# Altium schematic sheet INC-QT1-R-005.SchDoc
size A3
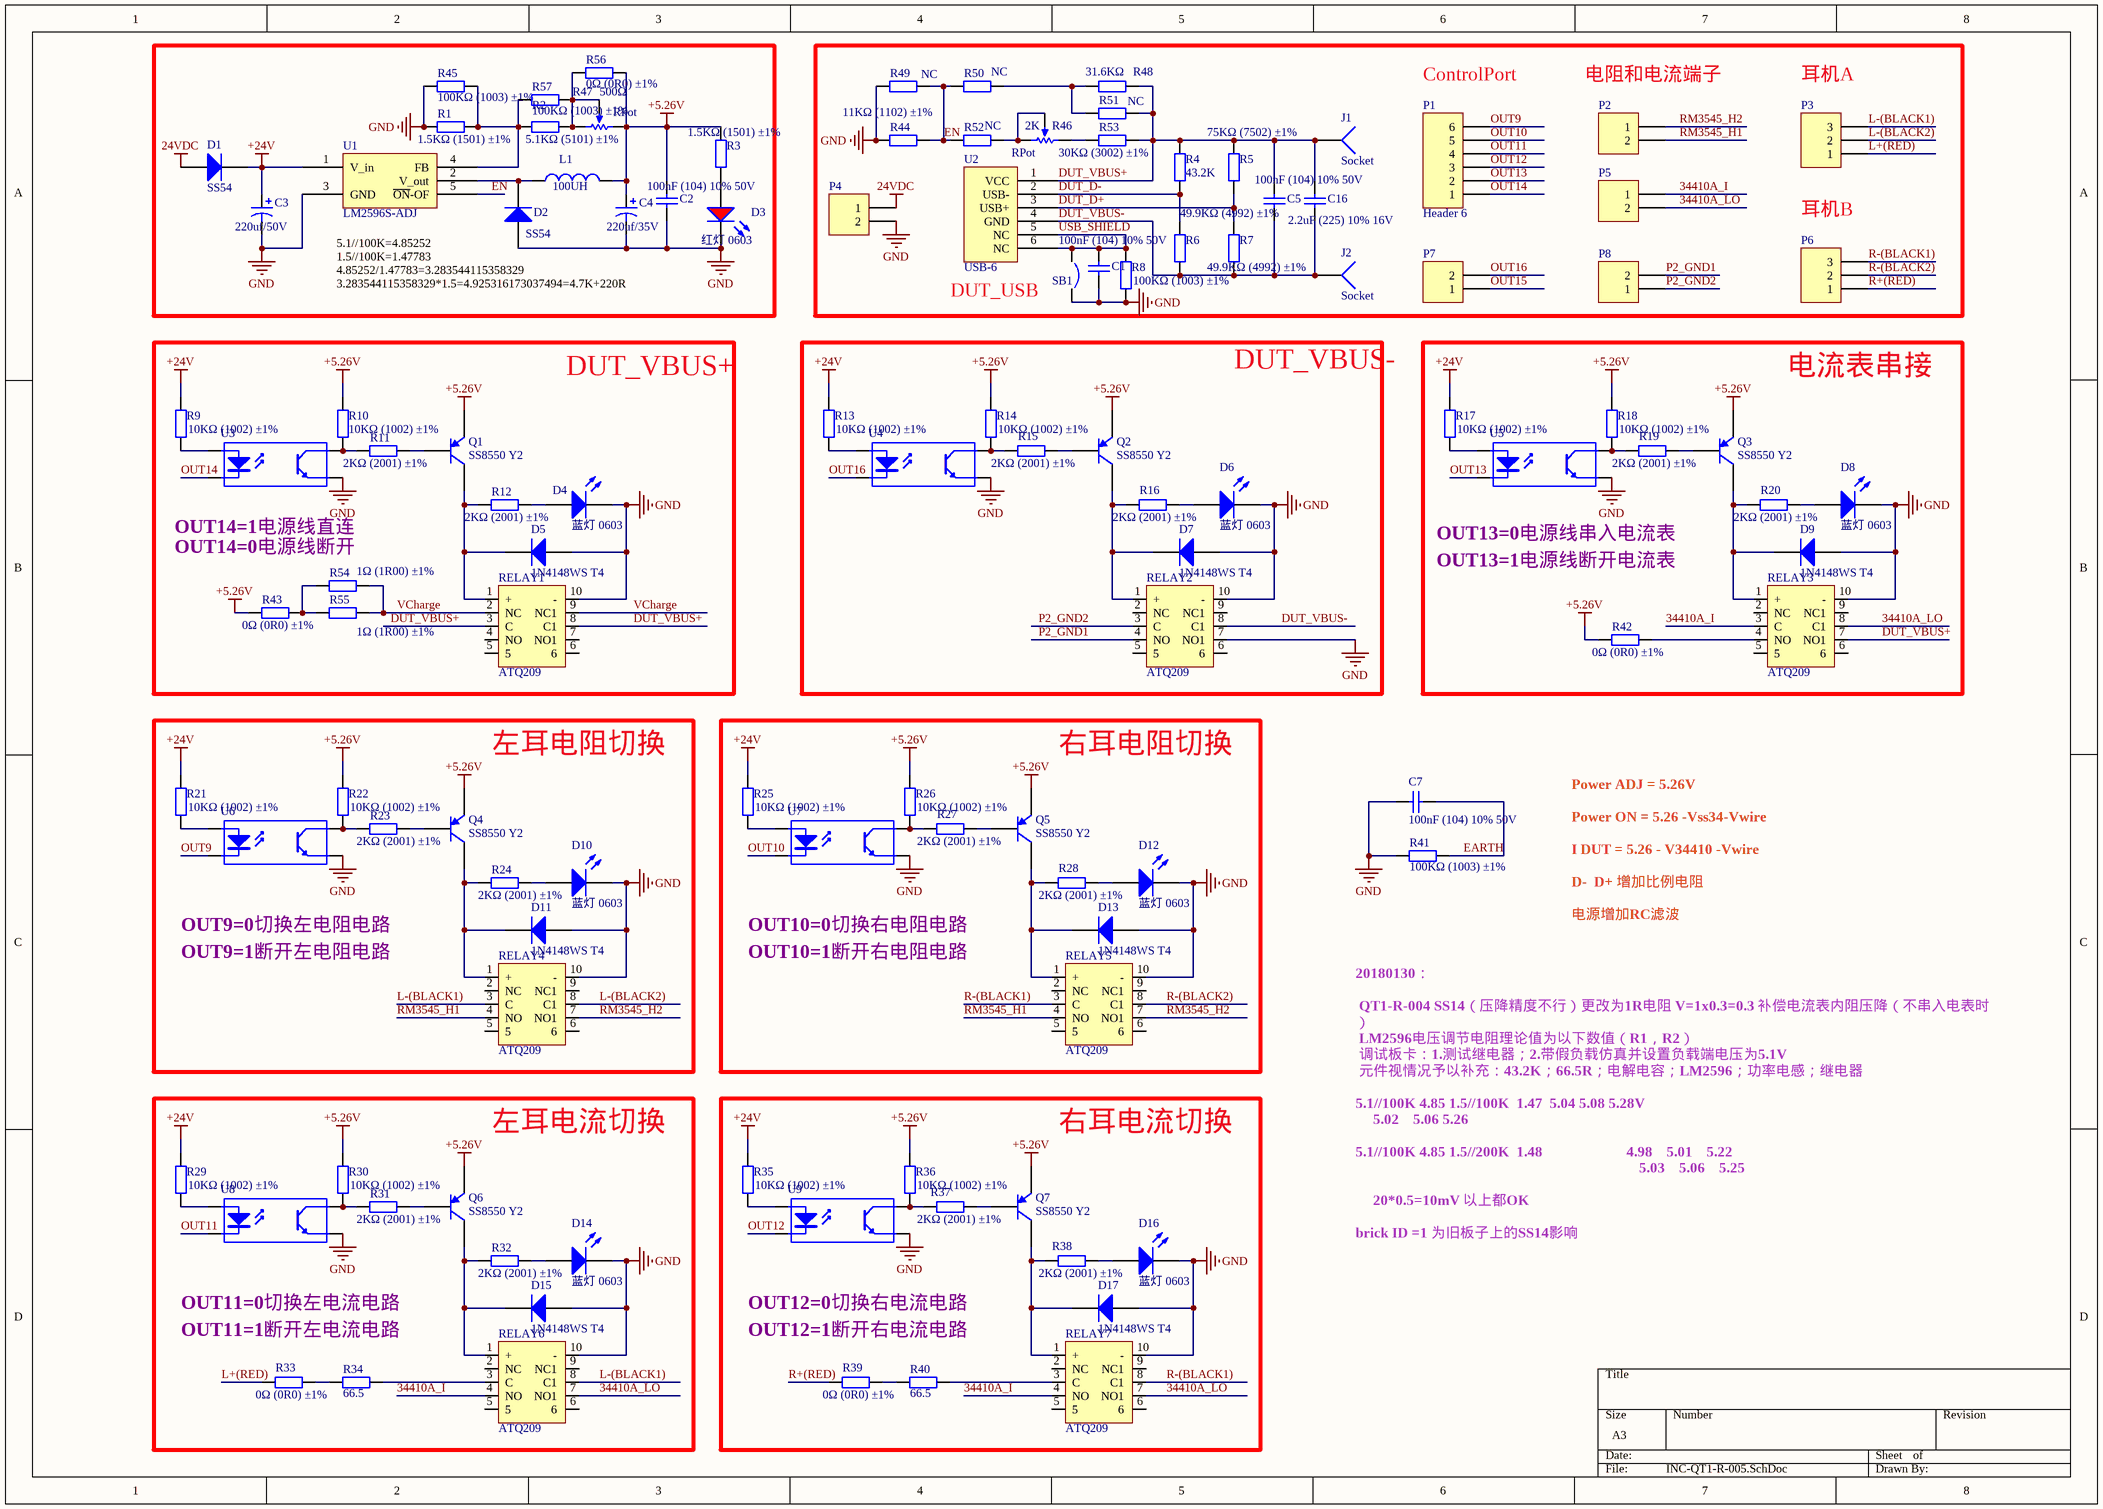
[diagram p0: INC-QT1-R-005.SchDoc]

## Parts
C1  100nF (104) 10% 50V  [0603_C]
C2  100nF (104) 10% 50V  [0603_C]
C3  220uf/50V  [贴片电解 10mm X 10mm]
C4  220uf/35V  [贴片电解 8mm X 10mm]
C5  100nF (104) 10% 50V  [0603_C]
C7  100nF (104) 10% 50V  [0603_C]
C16  2.2uF (225) 10% 16V  [0603_C]
D1  SS54  [SMA(DO-214AC)_S1]
D2  SS54  [SMA(DO-214AC)_S1]
D3  红灯 0603  [0603_LED_S1]
D4  蓝灯 0603  [0603_LED_S1]
D5  1N4148WS T4  [SOD-323]
D6  蓝灯 0603  [0603_LED_S1]
D7  1N4148WS T4  [SOD-323]
D8  蓝灯 0603  [0603_LED_S1]
D9  1N4148WS T4  [SOD-323]
D10  蓝灯 0603  [0603_LED_S1]
D11  1N4148WS T4  [SOD-323]
D12  蓝灯 0603  [0603_LED_S1]
D13  1N4148WS T4  [SOD-323]
D14  蓝灯 0603  [0603_LED_S1]
D15  1N4148WS T4  [SOD-323]
D16  蓝灯 0603  [0603_LED_S1]
D17  1N4148WS T4  [SOD-323]
J1  Socket  [TP]
J2  Socket  [TP]
L1  100UH  [贴片电感 12*12]
P1  Header 6  [WJ15EDGVC-3.81-6P]
P2  Header 2  [WJ15EDGVC-3.81-2P]  (value not drawn)
P3  Header 3  [WJ15EDGVC-3.81-3P]  (value not drawn)
P4  Header 2  [WJ15EDGVC-3.81-2P]  (value not drawn)
P5  Header 2  [WJ15EDGVC-3.81-2P]  (value not drawn)
P6  Header 3  [WJ15EDGVC-3.81-3P]  (value not drawn)
P7  Header 2  [WJ15EDGVC-3.81-2P]  (value not drawn)
P8  Header 2  [WJ15EDGVC-3.81-2P]  (value not drawn)
Q1  SS8550 Y2  [SOT-23(SOT-23-3)]
Q2  SS8550 Y2  [SOT-23(SOT-23-3)]
Q3  SS8550 Y2  [SOT-23(SOT-23-3)]
Q4  SS8550 Y2  [SOT-23(SOT-23-3)]
Q5  SS8550 Y2  [SOT-23(SOT-23-3)]
Q6  SS8550 Y2  [SOT-23(SOT-23-3)]
Q7  SS8550 Y2  [SOT-23(SOT-23-3)]
R1  1.5KΩ (1501) ±1%  [0603_R]
R2  5.1KΩ (5101) ±1%  [0603_R]
R3  1.5KΩ (1501) ±1%  [0603_R]
R4  43.2K  [0603_R]
R5  75KΩ (7502) ±1%  [0603_R]
R6  49.9KΩ (4992) ±1%  [0603_R]
R7  49.9KΩ (4992) ±1%  [0603_R]
R8  100KΩ (1003) ±1%  [0603_R]
R9  10KΩ (1002) ±1%  [0603_R]
R10  10KΩ (1002) ±1%  [0603_R]
R11  2KΩ (2001) ±1%  [0603_R]
R12  2KΩ (2001) ±1%  [0603_R]
R13  10KΩ (1002) ±1%  [0603_R]
R14  10KΩ (1002) ±1%  [0603_R]
R15  2KΩ (2001) ±1%  [0603_R]
R16  2KΩ (2001) ±1%  [0603_R]
R17  10KΩ (1002) ±1%  [0603_R]
R18  10KΩ (1002) ±1%  [0603_R]
R19  2KΩ (2001) ±1%  [0603_R]
R20  2KΩ (2001) ±1%  [0603_R]
R21  10KΩ (1002) ±1%  [0603_R]
R22  10KΩ (1002) ±1%  [0603_R]
R23  2KΩ (2001) ±1%  [0603_R]
R24  2KΩ (2001) ±1%  [0603_R]
R25  10KΩ (1002) ±1%  [0603_R]
R26  10KΩ (1002) ±1%  [0603_R]
R27  2KΩ (2001) ±1%  [0603_R]
R28  2KΩ (2001) ±1%  [0603_R]
R29  10KΩ (1002) ±1%  [0603_R]
R30  10KΩ (1002) ±1%  [0603_R]
R31  2KΩ (2001) ±1%  [0603_R]
R32  2KΩ (2001) ±1%  [0603_R]
R33  0Ω (0R0) ±1%  [0805_R]
R34  66.5  [2512_R]
R35  10KΩ (1002) ±1%  [0603_R]
R36  10KΩ (1002) ±1%  [0603_R]
R37  2KΩ (2001) ±1%  [0603_R]
R38  2KΩ (2001) ±1%  [0603_R]
R39  0Ω (0R0) ±1%  [0805_R]
R40  66.5  [2512_R]
R41  100KΩ (1003) ±1%  [0603_R]
R42  0Ω (0R0) ±1%  [0805_R]
R43  0Ω (0R0) ±1%  [0805_R]
R44  11KΩ (1102) ±1%  [0603_R]
R45  100KΩ (1003) ±1%  [0603_R]
R46  RPot  value 2K  [插件可调电阻 3362P]
R47  RPot  value 500Ω  [插件可调电阻 3362P]
R48  31.6KΩ  [0603_R]
R49  NC  [0603_R]
R50  NC  [0603_R]
R51  NC  [0603_R]
R52  NC  [0603_R]
R53  30KΩ (3002) ±1%  [0603_R]
R54  1Ω (1R00) ±1%  [1206_R]
R55  1Ω (1R00) ±1%  [1206_R]
R56  0Ω (0R0) ±1%  [0603_R]
R57  100KΩ (1003) ±1%  [0603_R]
RELAY1  ATQ209  [插件继电器 TQ2-5V]
RELAY2  ATQ209  [插件继电器 TQ2-5V]
RELAY3  ATQ209  [插件继电器 TQ2-5V]
RELAY4  ATQ209  [插件继电器 TQ2-5V]
RELAY5  ATQ209  [插件继电器 TQ2-5V]
RELAY6  ATQ209  [插件继电器 TQ2-5V]
RELAY7  ATQ209  [插件继电器 TQ2-5V]
SB1  Circuit Breaker  [JP2_SMD]  (value not drawn)
U1  LM2596S-ADJ  [LM2596-ADJ-263-5]
U2  USB-6  [USB_TypeA]
U3  EL357N(B)(TA)-G  [SOP-4_P2.54]  (value not drawn)
U4  EL357N(B)(TA)-G  [SOP-4_P2.54]  (value not drawn)
U5  EL357N(B)(TA)-G  [SOP-4_P2.54]  (value not drawn)
U6  EL357N(B)(TA)-G  [SOP-4_P2.54]  (value not drawn)
U7  EL357N(B)(TA)-G  [SOP-4_P2.54]  (value not drawn)
U8  EL357N(B)(TA)-G  [SOP-4_P2.54]  (value not drawn)
U9  EL357N(B)(TA)-G  [SOP-4_P2.54]  (value not drawn)

## Blocks framed on the sheet
DUT_VBUS+: D4 D5 Q1 R9-R12 R43 R54 R55 RELAY1 U3
DUT_VBUS-: D6 D7 Q2 R13-R16 RELAY2 U4
电流表串接: D8 D9 Q3 R17-R20 R42 RELAY3 U5
左耳电阻切换: D10 D11 Q4 R21-R24 RELAY4 U6
右耳电阻切换: D12 D13 Q5 R25-R28 RELAY5 U7
左耳电流切换: D14 D15 Q6 R29-R34 RELAY6 U8
右耳电流切换: D16 D17 Q7 R35-R40 RELAY7 U9

## Nets
24VDC: D1.1(A) P4.1
+5.26V: C2.2 C4.1 L1.2 Q1.2(E) Q2.2(E) Q3.2(E) Q4.2(E) Q5.2(E) Q6.2(E) Q7.2(E) R3.2 R10.2 R14.2 R18.2 R22.2 R26.2 R30.2 R36.2 R42.1 R43.1 R47.1(TOP) R56.2
+24V: C3.1 D1.2(K) R9.2 R13.2 R17.2 R21.2 R25.2 R29.2 R35.2 U1.1(V_in)
GND: C1.1 C2.1 C3.2 C4.2 C7.2 D2.1(A) D3.K D4.K D5.1(A) D6.K D7.1(A) D8.K D9.1(A) D10.K D11.1(A) D12.K D13.1(A) D14.K D15.1(A) D16.K D17.1(A) P4.2 R1.1 R8.1 R41.2 R44.1 R45.1 R49.1 RELAY1.10(-) RELAY2.7(NO1) RELAY2.10(-) RELAY3.10(-) RELAY4.10(-) RELAY5.10(-) RELAY6.10(-) RELAY7.10(-) SB1.2 U1.3(GND) U3.3(E) U4.3(E) U5.3(E) U6.3(E) U7.3(E) U8.3(E) U9.3(E)
34410A_I: P5.1 RELAY3.3(C) RELAY6.4(NO) RELAY7.4(NO)
34410A_LO: P5.2 RELAY3.8(C1) RELAY6.7(NO1) RELAY7.7(NO1)
DUT_D+: R5.1 R7.2 U2.3(USB+)
DUT_D-: R4.1 R6.2 U2.2(USB-)
DUT_VBUS+: C5.2 C16.2 J1.1 R4.2 R5.2 R48.2 R51.2 R53.2 RELAY1.3(C) RELAY1.8(C1) RELAY3.7(NO1) U2.1(VCC)
DUT_VBUS-: C5.1 C16.1 J2.1 R6.1 R7.1 RELAY2.8(C1) U2.4(GND)
EARTH: C7.1 R41.1
EN: R44.2 R49.2 R50.1 R52.1 U1.5(~{ON}-OF)
L+(RED): P3.1 R33.1
L-(BLACK1): P3.3 RELAY4.3(C) RELAY6.8(C1)
L-(BLACK2): P3.2 RELAY4.8(C1)
OUT9: P1.6 U6.2(K)
OUT10: P1.5 U7.2(K)
OUT11: P1.4 U8.2(K)
OUT12: P1.3 U9.2(K)
OUT13: P1.2 U5.2(K)
OUT14: P1.1 U3.2(K)
OUT15: P7.1
OUT16: P7.2 U4.2(K)
P2_GND1: P8.2 RELAY2.4(NO)
P2_GND2: P8.1 RELAY2.3(C)
R+(RED): P6.1 R39.1
R-(BLACK1): P6.3 RELAY5.3(C) RELAY7.8(C1)
R-(BLACK2): P6.2 RELAY5.8(C1)
RM3545_H1: P2.2 RELAY4.4(NO) RELAY5.4(NO)
RM3545_H2: P2.1 RELAY4.7(NO1) RELAY5.7(NO1)
USB_SHIELD: C1.2 R8.2 SB1.1 U2.5(NC) U2.6(NC)
VCharge: R54.1 R55.2 RELAY1.2(NC) RELAY1.9(NC1)
NetD2_2: D2.2(K) L1.1 U1.2(V_out)
NetD3_A: D3.A R3.1
NetD4_A: D4.A R12.2
NetD5_2: D5.2(K) Q1.3(C) R12.1 RELAY1.1(+)
NetD6_A: D6.A R16.2
NetD7_2: D7.2(K) Q2.3(C) R16.1 RELAY2.1(+)
NetD8_A: D8.A R20.2
NetD9_2: D9.2(K) Q3.3(C) R20.1 RELAY3.1(+)
NetD10_A: D10.A R24.2
NetD11_2: D11.2(K) Q4.3(C) R24.1 RELAY4.1(+)
NetD12_A: D12.A R28.2
NetD13_2: D13.2(K) Q5.3(C) R28.1 RELAY5.1(+)
NetD14_A: D14.A R32.2
NetD15_2: D15.2(K) Q6.3(C) R32.1 RELAY6.1(+)
NetD16_A: D16.A R38.2
NetD17_2: D17.2(K) Q7.3(C) R38.1 RELAY7.1(+)
NetQ1_1: Q1.1(B) R11.2
NetQ2_1: Q2.1(B) R15.2
NetQ3_1: Q3.1(B) R19.2
NetQ4_1: Q4.1(B) R23.2
NetQ5_1: Q5.1(B) R27.2
NetQ6_1: Q6.1(B) R31.2
NetQ7_1: Q7.1(B) R37.2
NetR1_2: R1.2 R2.1 R45.2 R57.1 U1.4(FB)
NetR2_2: R2.2 R47.2(BOT) R47.3(TAP) R56.1 R57.2
NetR9_1: R9.1 U3.1(A)
NetR10_1: R10.1 R11.1 U3.4(C)
NetR13_1: R13.1 U4.1(A)
NetR14_1: R14.1 R15.1 U4.4(C)
NetR17_1: R17.1 U5.1(A)
NetR18_1: R18.1 R19.1 U5.4(C)
NetR21_1: R21.1 U6.1(A)
NetR22_1: R22.1 R23.1 U6.4(C)
NetR25_1: R25.1 U7.1(A)
NetR26_1: R26.1 R27.1 U7.4(C)
NetR29_1: R29.1 U8.1(A)
NetR30_1: R30.1 R31.1 U8.4(C)
NetR33_2: R33.2 R34.2
NetR34_1: R34.1 RELAY6.3(C)
NetR35_1: R35.1 U9.1(A)
NetR36_1: R36.1 R37.1 U9.4(C)
NetR39_2: R39.2 R40.2
NetR40_1: R40.1 RELAY7.3(C)
NetR42_2: R42.2 RELAY3.4(NO)
NetR43_2: R43.2 R54.2 R55.1
NetR46_1: R46.1(TOP) R53.1
NetR46_2: R46.2(BOT) R46.3(TAP) R52.2
NetR48_1: R48.1 R50.2 R51.1

Not connected (* = marked no-connect by the designer): RELAY1 4(NO) 5 6 7(NO1); RELAY2 2(NC) 5 6 9(NC1); RELAY3 2(NC) 5 6 9(NC1); RELAY4 2(NC) 5 6 9(NC1); RELAY5 2(NC) 5 6 9(NC1); RELAY6 2(NC) 5 6 9(NC1); RELAY7 2(NC) 5 6 9(NC1)

## Notes on the sheet
- (near P1) ControlPort
- (near P2) 电阻和电流端子
- (near P3) 耳机A
- 耳机B
- 5.1//100K=4.85252
  1.5//100K=1.47783
  4.85252/1.47783=3.283544115358329
  3.283544115358329*1.5=4.925316173037494=4.7K+220R
- (near U2) DUT_USB
- OUT14=1电源线直连
- OUT14=0电源线断开
- (near U5) OUT13=0电源线串入电流表
- OUT13=1电源线断开电流表
- OUT9=0切换左电阻电路
- OUT9=1断开左电阻电路
- OUT10=0切换右电阻电路
- OUT10=1断开右电阻电路
- Power ADJ = 5.26V
  Power ON = 5.26 -Vss34-Vwire
  I DUT = 5.26 - V34410 -Vwire
  D-  D+ 增加比例电阻
  电源增加RC滤波
- OUT11=0切换左电流电路
- OUT12=0切换右电流电路
- 20180130：
  QT1-R-004 SS14（压降精度不行）更改为1R电阻 V=1x0.3=0.3 补偿电流表内阻压降（不串入电表时）
  LM2596电压调节电阻理论值为以下数值（R1，R2）
  调试板卡：1.测试继电器；2.带假负载仿真并设置负载端电压为5.1V
  元件视情况予以补充：43.2K；66.5R；电解电容；LM2596；功率电感；继电器
  5.1//100K 4.85	1.5//100K  1.47		5.04	5.08	5.28V
  5.02    5.06	5.26
  5.1//100K 4.85	1.5//200K  1.48                        4.98    5.01    5.22
  5.03    5.06    5.25
  20*0.5=10mV 以上都OK
  brick ID =1 为旧板子上的SS14影响
- OUT11=1断开左电流电路
- OUT12=1断开右电流电路

## Library data of the parts
C1 C2 C5 C7 = 0603 100nF (104) 10% 50V: 贴片电容; ComponentLink1Description: 供应商链接; ComponentLink1URL: http://www.szlcsc.com/product/details_15331.html; Package: 0603; Supplier: LC; SuppliersPartNumber: C14663
C3 C4 = Cap Pol1: Polarized Capacitor (Radial); Published: 8-Jun-2000; LatestRevisionDate: 17-Jul-2002; LatestRevisionNote: Re-released for DXP Platform.; PackageReference: RB7.6-15; Publisher: Altium Limited
  C3: Value: 220uf/50V
  C4: Value: 220uf/35V
C16 = 0603 2.2uF (225) 10% 16V: 贴片电容; ComponentLink1Description: 供应商链接; ComponentLink1URL: http://www.szlcsc.com/product/details_24366.html; Package: 0603; Supplier: LC; SuppliersPartNumber: C23630
D1 D2 = SMA(DO-214AC) SS54: 二极管; ComponentLink1Description: 供应商链接; ComponentLink1URL: http://www.szlcsc.com/product/details_23178.html; Package: SMA(DO-214AC); Supplier: LC; SuppliersPartNumber: C22452
D3 = 0603 红灯: 发光二极管; ComponentLink1Description: 供应商链接; ComponentLink1URL: http://www.szlcsc.com/product/details_2659.html; Package: 0603; Supplier: LC; SuppliersPartNumber: C2286
D4 D6 D8 D10 D12 D14 D16 = 0603 蓝灯: 发光二极管; ComponentLink1Description: 供应商链接; ComponentLink1URL: http://www.szlcsc.com/product/details_73150.html; Package: 0603; Supplier: LC; SuppliersPartNumber: C72041
D5 D7 D9 D11 D13 D15 D17 = SOD-323 1N4148WS T4: 二极管; ComponentLink1Description: 供应商链接; ComponentLink1URL: http://www.szlcsc.com/product/details_2485.html; Package: SOD-323; Supplier: LC; SuppliersPartNumber: C2128
L1 = Inductor: Code_IEC: 1005; Published: 8-Jun-2000; LatestRevisionDate: 29-May-2009; LatestRevisionNote: IPC-7351 Footprint Added.; PackageReference: 0402-A; Publisher: Altium Limited; PackageDescription: Chip Inductor; Code_JEITA: 0402; Value: 100UH
P1 = Header 6: Header, 6-Pin; LatestRevisionDate: 17-Jul-2002; LatestRevisionNote: Re-released for DXP Platform.; Publisher: Altium Limited
P2 P4 P5 P7 P8 = Header 2: Header, 2-Pin; LatestRevisionDate: 17-Jul-2002; LatestRevisionNote: Re-released for DXP Platform.; Publisher: Altium Limited
P3 P6 = Header 3: Header, 3-Pin; LatestRevisionDate: 17-Jul-2002; LatestRevisionNote: Re-released for DXP Platform.; Publisher: Altium Limited
Q1-Q7 = SOT-23 SS8550 Y2: 三极管; ComponentLink1Description: 供应商链接; ComponentLink1URL: http://www.szlcsc.com/product/details_9037.html; Package: SOT-23; Supplier: LC; SuppliersPartNumber: C8542
R1 R3 = 0603 1.5KΩ (1501) 1%: 贴片电阻; ComponentLink1Description: 供应商链接; ComponentLink1URL: http://www.szlcsc.com/product/details_23570.html; Package: 0603; Supplier: LC; SuppliersPartNumber: C22843
R2 = 0603 5.1KΩ (5101) 1%: 贴片电阻; ComponentLink1Description: 供应商链接; ComponentLink1URL: http://www.szlcsc.com/product/details_23913.html; Package: 0603; Supplier: LC; SuppliersPartNumber: C23186
R4 R34 R40 = Res2: Resistor; Published: 8-Jun-2000; LatestRevisionDate: 17-Jul-2002; LatestRevisionNote: Re-released for DXP Platform.; PackageReference: AXIAL-0.4; Publisher: Altium Limited
  R4: Value: 43.2K
  R34 R40: Value: 66.5
R5 = 0603 75KΩ (7502) 1%: 贴片电阻; ComponentLink1Description: 供应商链接; ComponentLink1URL: http://www.szlcsc.com/product/details_23969.html; Package: 0603; Supplier: LC; SuppliersPartNumber: C23242
R6 R7 = 0603 49.9KΩ (4992) 1%: 贴片电阻; ComponentLink1Description: 供应商链接; ComponentLink1URL: http://www.szlcsc.com/product/details_23911.html; Package: 0603; Supplier: LC; SuppliersPartNumber: C23184
R8 R41 R45 R57 = 0603 100KΩ (1003) 1%: 贴片电阻; ComponentLink1Description: 供应商链接; ComponentLink1URL: http://www.szlcsc.com/product/details_26546.html; Package: 0603; Supplier: LC; SuppliersPartNumber: C25803
R9 R10 R13 R14 R17 R18 R21 R22 R25 R26 R29 R30 R35 R36 = 0603 10KΩ (1002) 1%: 贴片电阻; ComponentLink1Description: 供应商链接; ComponentLink1URL: http://www.szlcsc.com/product/details_26547.html; Package: 0603; Supplier: LC; SuppliersPartNumber: C25804
R11 R12 R15 R16 R19 R20 R23 R24 R27 R28 R31 R32 R37 R38 = 0603 2KΩ (2001) 1%: 贴片电阻; ComponentLink1Description: 供应商链接; ComponentLink1URL: http://www.szlcsc.com/product/details_23702.html; Package: 0603; Supplier: LC; SuppliersPartNumber: C22975
R33 R39 R42 R43 = 0805 0Ω (0R0) 1%: 贴片电阻; ComponentLink1Description: 供应商链接; ComponentLink1URL: http://www.szlcsc.com/product/details_18165.html; Package: 0805; Supplier: LC; SuppliersPartNumber: C17477
R44 = 0603 11KΩ (1102) 1%: 贴片电阻; ComponentLink1Description: 供应商链接; ComponentLink1URL: http://www.szlcsc.com/product/details_26693.html; Package: 0603; Supplier: LC; SuppliersPartNumber: C25950
R46 R47 = RPot: Potentiometer; Sim Note: Enter the Resistance value and the set point into parameter fields.; Set Position: 0.5; Published: 8-Jun-2000; LatestRevisionDate: 17-Jul-2002; LatestRevisionNote: Re-released for DXP Platform.; PackageReference: VR5; Publisher: Altium Limited; PackageDescription: Variable Resistor, Thru-Hole; 3 Leads
R48 R49 R51 = 0603 510KΩ (5103) 1%: 贴片电阻; ComponentLink1Description: 供应商链接; ComponentLink1URL: http://www.szlcsc.com/product/details_23919.html; Package: 0603; Supplier: LC; SuppliersPartNumber: C23192
R50 R52 R56 = 0603 0Ω (0R0) 1%: 贴片电阻; ComponentLink1Description: 供应商链接; ComponentLink1URL: http://www.szlcsc.com/product/details_21903.html; Package: 0603; Supplier: LC; SuppliersPartNumber: C21189
R53 = 0603 30KΩ (3002) 1%: 贴片电阻; ComponentLink1Description: 供应商链接; ComponentLink1URL: http://www.szlcsc.com/product/details_23711.html; Package: 0603; Supplier: LC; SuppliersPartNumber: C22984
R54 R55 = 1206 1Ω (1R00) 1%: 贴片电阻; ComponentLink1Description: 供应商链接; ComponentLink1URL: http://www.szlcsc.com/product/details_18616.html; Package: 1206; Supplier: LC; SuppliersPartNumber: C17928
SB1 = Circuit Breaker: Solder: NO; Published: 24-Mar-1999; Revision: July-2002: Re-released for DXP Platform.; Publisher: Altium Limited
U1 = LM2596-ADJ
U3-U9 = Optoisolator1: 4-Pin Phototransistor Optocoupler; Published: 24-Mar-1999; LatestRevisionDate: 04-Mar-2005; LatestRevisionNote: Sch pins 3 & 4 Swapped.; DatasheetVersion: Nov-2003; PackageReference: DIP-4; Publisher: Altium Limited
J1 J2 = Socket: LatestRevisionDate: 17-Jul-2002; LatestRevisionNote: Re-released for DXP Platform.; Publisher: Altium Limited